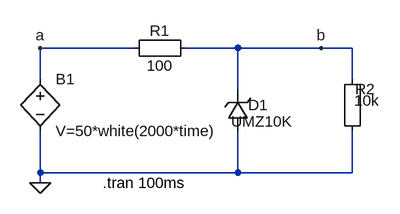
[diagram p0: schematic VL-P-P3.asc]
VL-P-P3.asc, the LTspice schematic file:
Version 4
SHEET 1 880 680
WIRE 16 112 -128 112
WIRE 176 112 96 112
WIRE 304 112 176 112
WIRE 352 112 304 112
WIRE -128 160 -128 112
WIRE 352 160 352 112
WIRE 176 176 176 112
WIRE -128 304 -128 240
WIRE 176 304 176 240
WIRE 176 304 -128 304
WIRE 352 304 352 240
WIRE 352 304 176 304
WIRE -128 320 -128 304
FLAG -128 112 a
FLAG 304 112 b
FLAG -128 320 0
SYMBOL Misc\\EuropeanResistor 112 96 R90
WINDOW 0 5 56 VBottom 2
WINDOW 3 27 56 VTop 2
SYMATTR InstName R1
SYMATTR Value 100
SYMBOL zener 192 240 R180
WINDOW 0 -31 40 Left 2
WINDOW 3 -69 15 Left 2
SYMATTR InstName D1
SYMATTR Value UMZ10K
SYMATTR Description Diode
SYMATTR Type diode
SYMBOL Misc\\EuropeanResistor 368 256 R180
WINDOW 0 -19 81 Left 2
WINDOW 3 -26 63 Left 2
SYMATTR InstName R2
SYMATTR Value 10k
SYMBOL bv -128 144 R0
SYMATTR InstName B1
SYMATTR Value V=50*white(2000*time)
TEXT -32 320 Left 2 !.tran 100ms

The netlist it stands for:
* VL-P-P3.asc
R1 b a 100
D1 0 b UMZ10K
R2 0 b 10k
B1 a 0 V=50*white(2000*time)
.model D D
.lib standard.dio
.tran 100ms
.backanno
.end